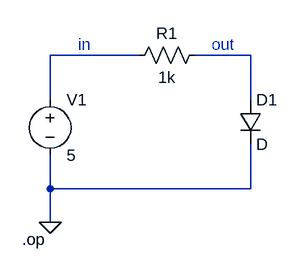
[diagram p0: schematic Assignment 2.2.asc]
Assignment 2.2.asc, the LTspice schematic file:
Version 4.1
SHEET 1 880 680
WIRE 224 64 96 64
WIRE 384 64 304 64
WIRE 96 128 96 64
WIRE 384 128 384 64
WIRE 96 256 96 208
WIRE 384 256 384 192
WIRE 384 256 96 256
WIRE 96 304 96 256
FLAG 96 304 0
SYMBOL voltage 96 112 R0
SYMATTR InstName V1
SYMATTR Value 5
SYMBOL res 320 48 R90
WINDOW 0 0 56 VBottom 2
WINDOW 3 32 56 VTop 2
SYMATTR InstName R1
SYMATTR Value 1k
SYMBOL diode 368 128 R0
SYMATTR InstName D1
TEXT 136 48 Left 2 ;in
TEXT 328 48 Left 2 ;out
TEXT 56 328 Left 2 !.op

The netlist it stands for:
* Assignment 2.2.asc
V1 N001 0 5
R1 N002 N001 1k
D1 N002 0 D
.model D D
.lib standard.dio
* in
* out
.op
.backanno
.end